# EAGLE design drive_board (EAGLE 8.4.0)
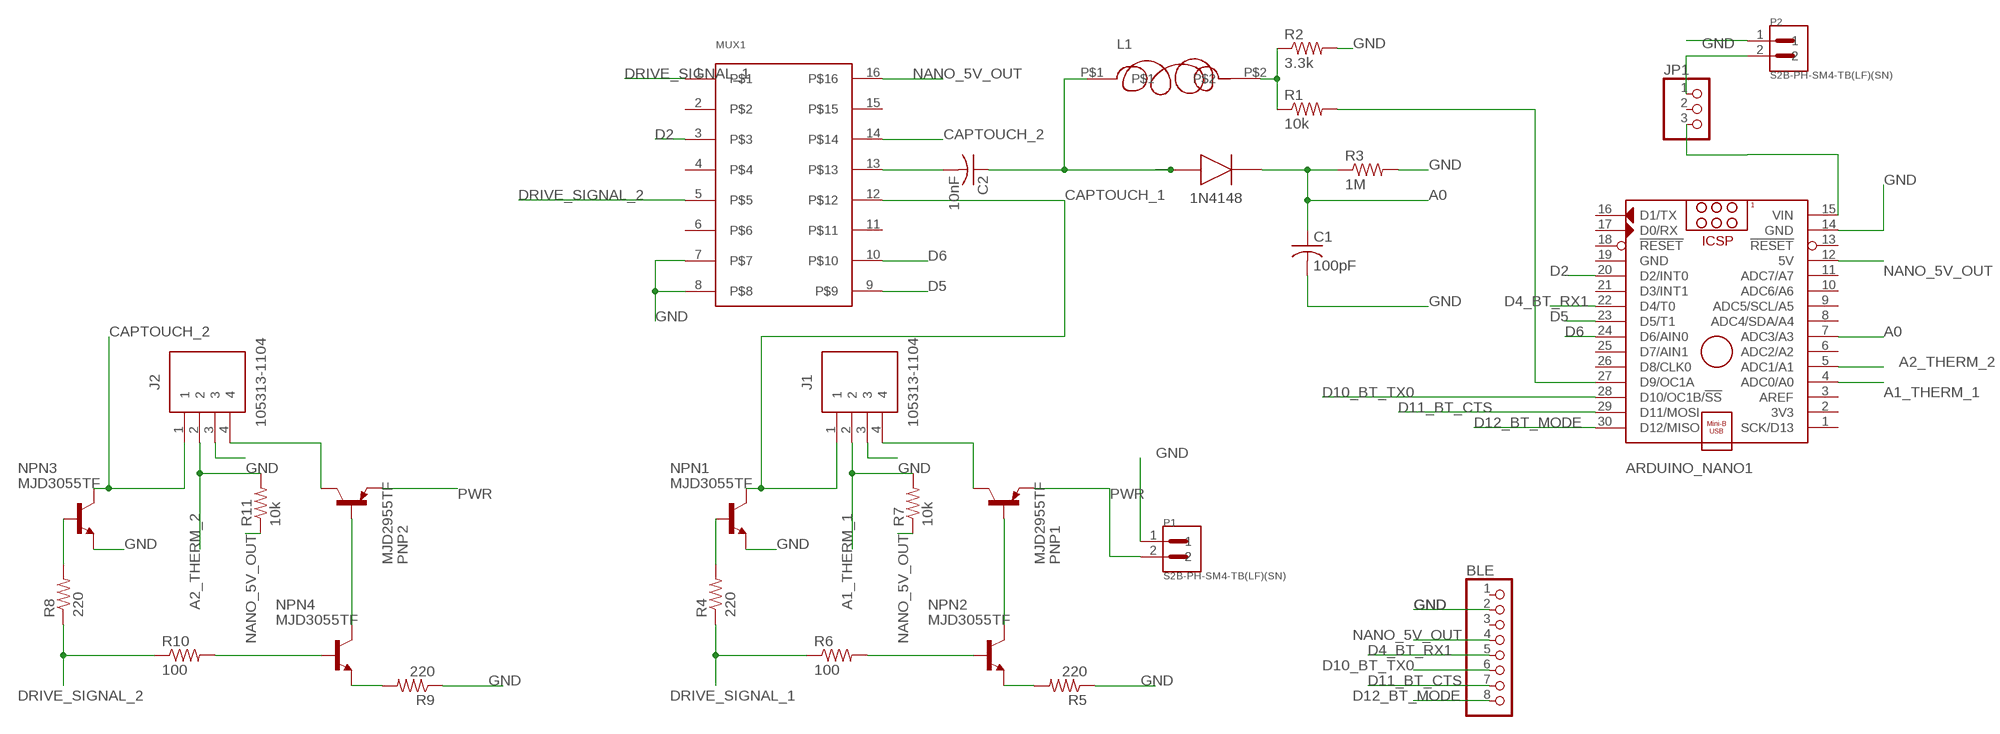
[diagram p0: schematic, sheet 1]

## Parts
1N4148  1N5819HW-7-F  [SOD3716X145N]
ARDUINO_NANO1  ARDUINO_NANO  [ARDUINO_NANO]
BLE  PINHD-1X8  [1X08]
C1  100pF  C-USC0805  [C0805]
C2  10nF  C-USC0805  [C0805]
J1  105313-1104  [105313-1104]
J2  105313-1104  [105313-1104]
JP1  PINHD-1X3  [1X03]
L1  SRE6603  [SRE6603]
MUX1  HAIRIO_MUX  [SO16]
NPN1  MJD3055TF  MJD31  [DPAK]
NPN2  MJD3055TF  MJD31  [DPAK]
NPN3  MJD3055TF  MJD31  [DPAK]
NPN4  MJD3055TF  MJD31  [DPAK]
P1  S2B-PH-SM4-TB(LF)(SN)  [JST_S2B-PH-SM4-TB(LF)(SN)]
P2  S2B-PH-SM4-TB(LF)(SN)  [JST_S2B-PH-SM4-TB(LF)(SN)]
PNP1  MJD2955TF  MJD32  [DPAK]
PNP2  MJD2955TF  MJD32  [DPAK]
R1  10k  R-US_R0805  [R0805]
R2  3.3k  R-US_R0805  [R0805]
R3  1M  R-US_R0805  [R0805]
R4  220  R-US_R0805  [R0805]
R5  220  R-US_R0805  [R0805]
R6  100  R-US_R0805  [R0805]
R7  10k  R-US_R0805  [R0805]
R8  220  R-US_R0805  [R0805]
R9  220  R-US_R0805  [R0805]
R10  100  R-US_R0805  [R0805]
R11  10k  R-US_R0805  [R0805]

## Nets
A0: 1N4148.1(K) ARDUINO_NANO1.7(ADC3/A3) C1.1 R3.1
A1_THERM_1 [isolation]: ARDUINO_NANO1.4(ADC0/A0) J1.2 R7.2
A2_THERM_2: ARDUINO_NANO1.5(ADC1/A1) J2.2 R11.2
CAPTOUCH_1 [isolation]: J1.1 MUX1.12 NPN1.4(C)
CAPTOUCH_2: J2.1 MUX1.14 NPN3.4(C)
D2: ARDUINO_NANO1.20(D2/INT0) MUX1.3
D4_BT_RX1: ARDUINO_NANO1.22(D4/T0) BLE.5
D5: ARDUINO_NANO1.23(D5/T1) MUX1.9
D6: ARDUINO_NANO1.24(D6/AIN0) MUX1.10
D10_BT_TX0: ARDUINO_NANO1.28(D10/OC1B/!SS) BLE.6
D11_BT_CTS: ARDUINO_NANO1.29(D11/MOSI) BLE.7
D12_BT_MODE: ARDUINO_NANO1.30(D12/MISO) BLE.8
DRIVE_SIGNAL_1 [isolation]: MUX1.1 R4.1 R6.1
DRIVE_SIGNAL_2: MUX1.5 R8.1 R10.1
GND: ARDUINO_NANO1.14(GND) BLE.2 C1.2 J1.3 J2.3 MUX1.7 MUX1.8 NPN1.3(E) NPN3.3(E) P1.1 P2.1 R2.2 R3.2 R5.1 R9.1
N$1: NPN2.1(B) R6.2
N$2: NPN2.3(E) R5.2
N$3: NPN4.1(B) R10.2
N$4: NPN2.4(C) PNP1.1(B)
N$5: NPN1.1(B) R4.2
N$6: C2.2 MUX1.13
N$7: 1N4148.2(A) C2.1 L1.P$1
N$8: J1.4 PNP1.4(C)
N$9: ARDUINO_NANO1.27(D9/OC1A) R1.2
N$10: L1.P$2 R1.1 R2.1
N$11: NPN4.3(E) R9.2
N$12: ARDUINO_NANO1.15(VIN) JP1.3
N$13: NPN4.4(C) PNP2.1(B)
N$14: NPN3.1(B) R8.2
N$15: J2.4 PNP2.4(C)
N$16: JP1.1 P2.2
NANO_5V_OUT: ARDUINO_NANO1.12(5V) BLE.4 MUX1.16 R7.1 R11.1
PWR: P1.2 PNP1.3(E) PNP2.3(E)
Unconnected: ARDUINO_NANO1.1(SCK/D13) ARDUINO_NANO1.2(3V3) ARDUINO_NANO1.3(AREF) ARDUINO_NANO1.6(ADC2/A2) ARDUINO_NANO1.8(ADC4/SDA/A4) ARDUINO_NANO1.9(ADC5/SCL/A5) ARDUINO_NANO1.10(ADC6/A6) ARDUINO_NANO1.11(ADC7/A7) ARDUINO_NANO1.13(!RESET) ARDUINO_NANO1.16(D1/TX) ARDUINO_NANO1.17(D0/RX) ARDUINO_NANO1.18(!RESET) ARDUINO_NANO1.21(D3/INT1) ARDUINO_NANO1.25(D7/AIN1) ARDUINO_NANO1.26(D8/CLK0) BLE.1 BLE.3 JP1.2 MUX1.2 MUX1.4 MUX1.6 MUX1.11 MUX1.15

## Power pins joined to a net without a drawn wire
GND: ARDUINO_NANO1.19(GND)

## Library data of the parts
1N4148 = hairiodiode:1N5819HW-7-F: Diode Schottky 1A 40V SOD123 Diodes Inc 1N5819HW-7-F, SMT Schottky Diode, 40V 1A, 2-Pin SOD-123 <https://componentsearchengine.com/Images/3/1N5819HW-7-F.jpg> Source: Datasheet <http://www.diodes.com/_files/datasheets/ds30217.pdf>; ALLIED_NUMBER: 70437201; DESCRIPTION: Diode Schottky 1A 40V SOD123 Diodes Inc 1N5819HW-7-F, SMT Schottky Diode, 40V 1A, 2-Pin SOD-123; HEIGHT: 1.45mm; MANUFACTURER_NAME: Diodes Inc.; MANUFACTURER_PART_NUMBER: 1N5819HW-7-F; RS_PART_NUMBER: 9227964; SUPPLIER_NAME: RS
ARDUINO_NANO1 = ArduinoNanoV30:ARDUINO_NANO: Arduino Nano V3.0 Module Overview: The Arduino Nano is a small, complete, and breadboard-friendly board based on the ATmega328 (Arduino Nano 3.x) or ATmega168 (Arduino Nano 2.x). It has more or less the same functionality of the Arduino Duemilanove, but in a different package. It lacks only a DC power jack, and works with a Mini-B USB cable instead of a standard one. The Nano was designed and is being produced by Gravitech <http://www.gravitech.us/arna30wiatp.html>. General specifications: Item Value Microcontroller Atmel ATmega168 or ATmega328 Operating Voltage (logic level) 5 V Input Voltage (recommended) 7-12 V Input Voltage (limits) 6-20 V Digital I/O Pins 14 (of which 6 provide PWM output) Analog Input Pins 8 DC Current per I/O Pin 40 mA Flash Memory 16 KB (ATmega168) or 32 KB (ATmega328) of which 2 KB used by bootloader SRAM 1 KB (ATmega168) or 2 KB (ATmega328) EEPROM 512 bytes (ATmega168) or 1 KB (ATmega328) Clock Speed 16 MHz Dimensions (Inches) 0.73" x 1.70" Dimensions (mm) 18mm x 45mm Overall height About 9 mm (not including pins) Weigth 5 g Power: The Arduino Nano can be powered via the Mini-B USB connection, 6-20V unregulated external power supply (pin 30), or 5V regulated external power supply (pin 27). The power source is automatically selected to the highest voltage source. Memory: The ATmega168 has 16 KB of flash memory for storing code (of which 2 KB is used for the bootloader); the ATmega328 has 32 KB, (also with 2 KB used for the bootloader). The ATmega168 has 1 KB of SRAM and 512 bytes of EEPROM (which can be read and written with the EEPROM library); the ATmega328 has 2 KB of SRAM and 1 KB of EEPROM. Input and Output: Each of the 14 digital pins on the Nano can be used as an input or output, using pinMode(), digitalWrite(), and digitalRead() functions. They operate at 5 volts. Each pin can provide or receive a maximum of 40 mA and has an internal pull-up resistor (disconnected by default) of 20-50 kOhms. In addition, some pins have specialized functions. Visit Arduino - ArduinoBoardNano <https://www.arduino.cc/en/Main/ArduinoBoardNano>
BLE = pinhead:PINHD-1X8: PIN HEADER
C1 C2 = resistor:C-US: CAPACITOR, American symbol
J1 J2 = 105313-1104:105313-1104: Headers & Wire Housings NanoFit RA Hdr TH SR 4Ckt Tin Blk <https://componentsearchengine.com/Images/1/105313-1104.jpg> Source: Datasheet <http://www.molex.com/webdocs/datasheets/pdf/en-us//1053131104_PCB_HEADERS.pdf>; DESCRIPTION: Headers & Wire Housings NanoFit RA Hdr TH SR 4Ckt Tin Blk; HEIGHT: mm; MANUFACTURER_NAME: Molex; MANUFACTURER_PART_NUMBER: 105313-1104; SUPPLIER_NAME: RS
JP1 = pinhead:PINHD-1X3: PIN HEADER
L1 = HairIO:SRE6603: SRE6603 - Shielded SMD Power Inductor Technical Specifications: Test Voltage: 0.1V Operating Temperature: -25°C to 105°C Digikey: SRE6603-103MCT-ND Mouser: 652-SRE6603-103M
MUX1 = 40xx:HAIRIO_MUX
NPN1-NPN4 = transistor:MJD31*: Complementary Power Transistors
P1 P2 = S2B-PH-SM4-TB_LF__SN_:S2B-PH-SM4-TB(LF)(SN): CONN HEADER PH SIDE 2POS 2MM SMD; AVAILABILITY: Good; DESCRIPTION: CONN HEADER PH SIDE 2POS 2MM SMD; MF: JST; MP: S2B-PH-SM4-TB(LF)(SN); PACKAGE: FakePackage u; PRICE: 0.34 USD
PNP1 PNP2 = transistor:MJD32*: Complementary Power Transistors
R1-R11 = resistor:R-US_: RESISTOR, American symbol

## Board
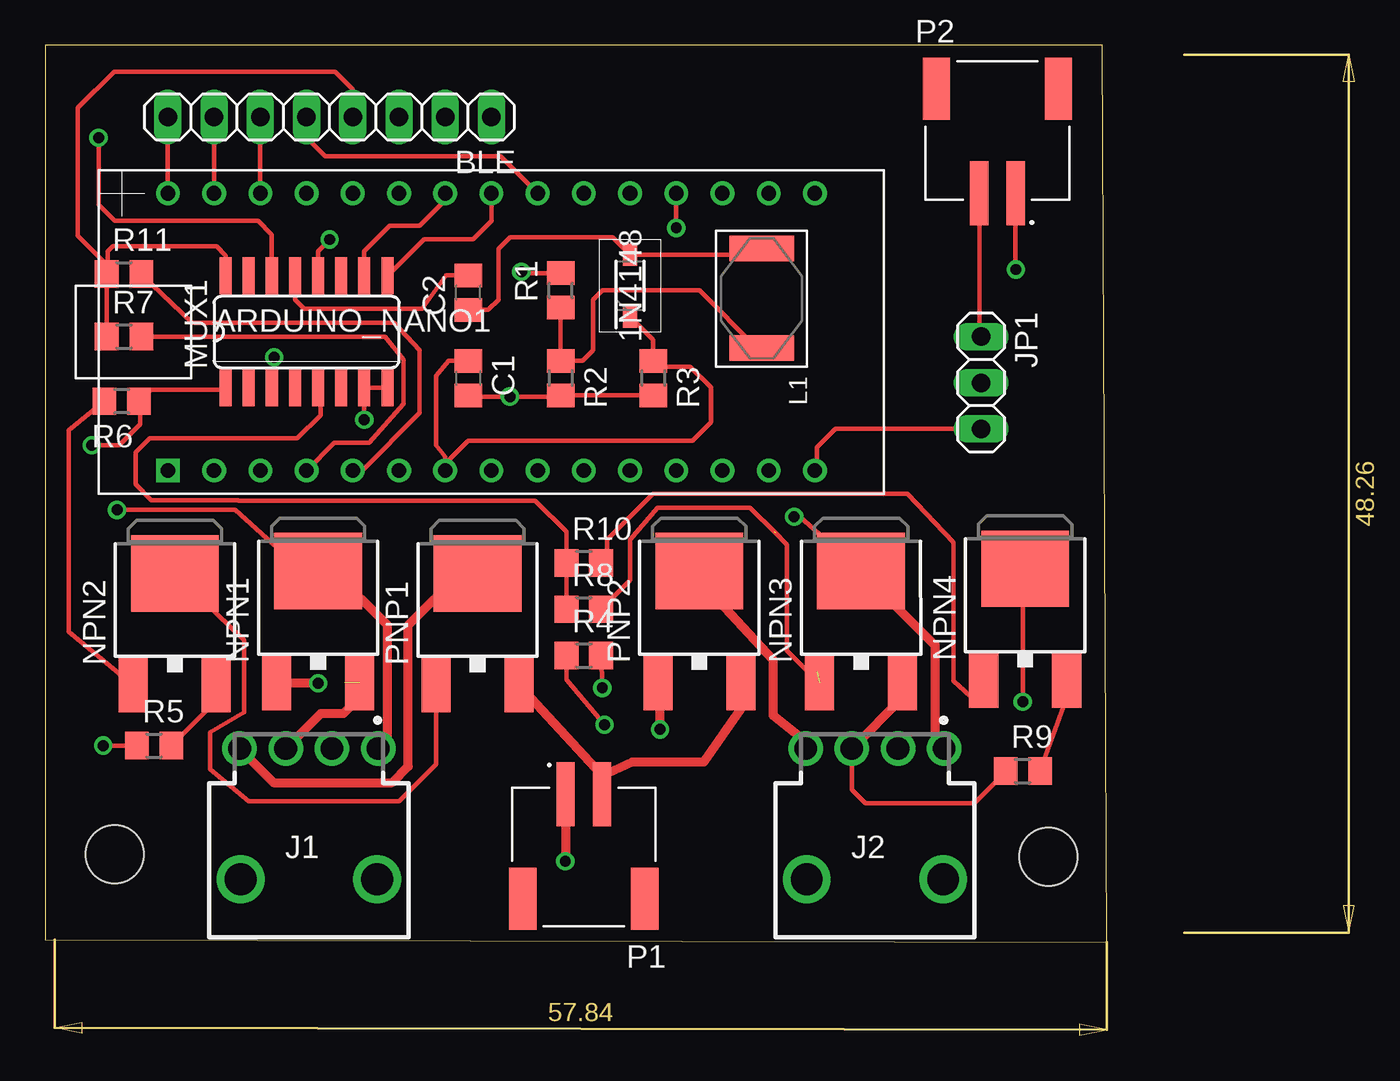
[diagram p1: board, top side]
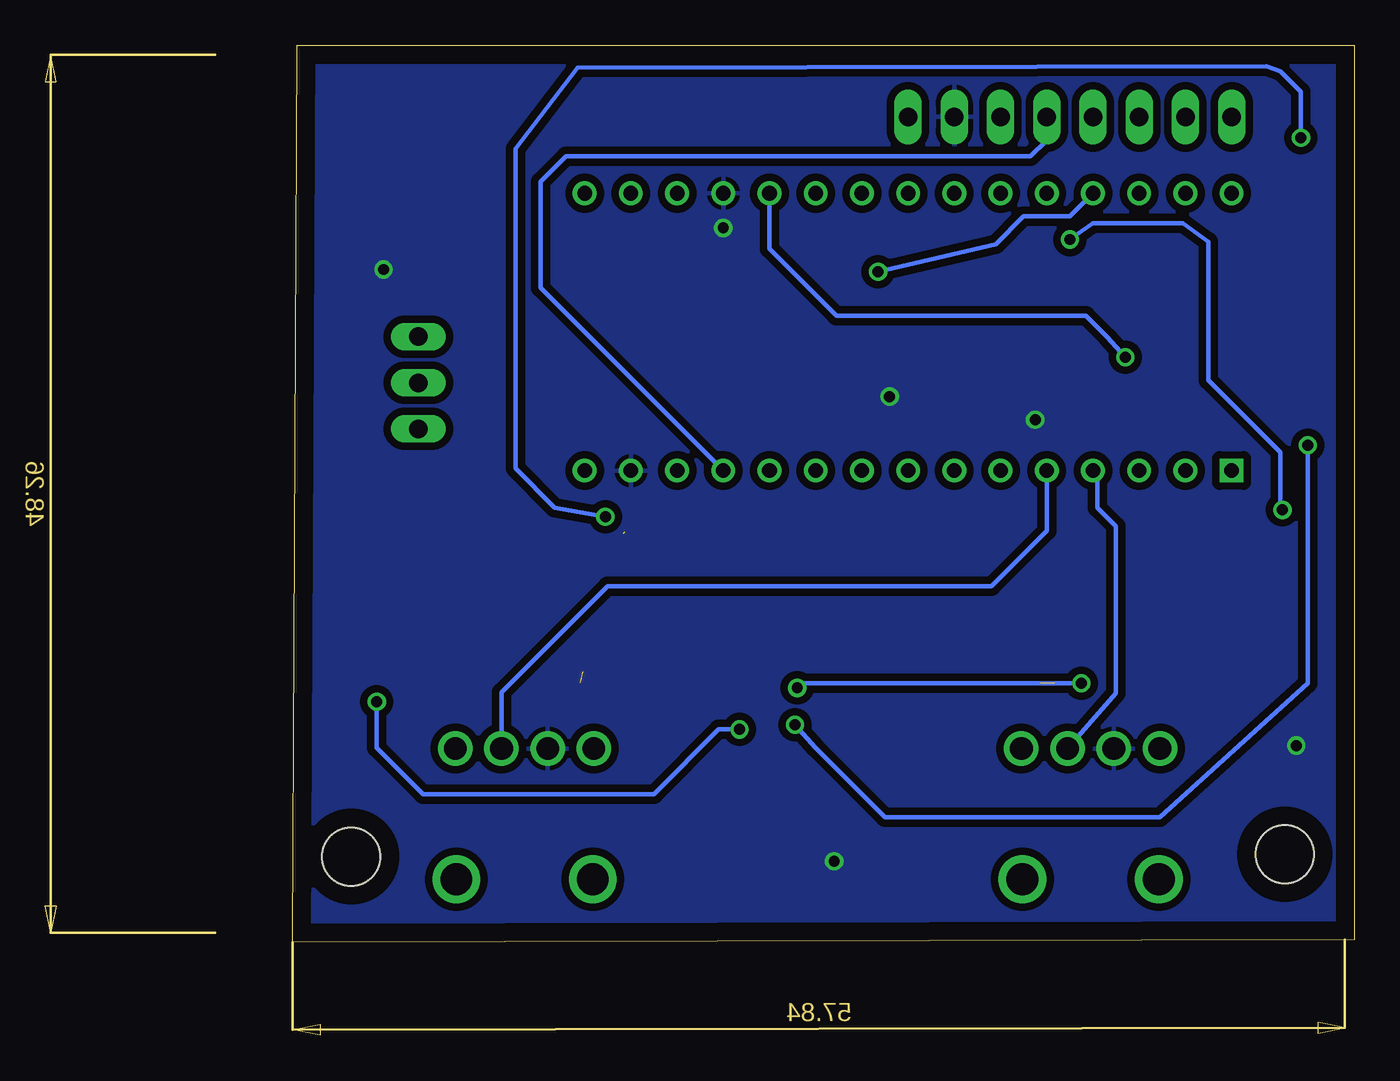
[diagram p2: board, bottom side, seen from below]

Size 58.34 x 49.27 mm. Coordinates in mm from the lower left corner, seen from the top.
Outline: 0,0.13 58.34,0 58.09,49.27 0,49.27 0,0.13
Copper layers (1*16): Top 0.035mm / dielectric 1.5mm / Bottom 0.035mm
Design rules "default": minimum track width 6mil, minimum drill 0.35mm, track to track 6mil, track to pad 6mil, pad to pad 6mil, via to via 6mil, smd to smd 6mil, copper to edge 40mil, drill to drill 6mil, minimum pad ring 10mil, minimum via ring 8mil, stop-mask expansion 4mil, vias tented up to drill 0mil, thermal gap 10mil
Holes 3.2 mm at 3.81,4.83 55.12,4.7

### Footprints (pad centres in the part's own frame; a part is rotated, then mirrored left to right if it is on the bottom)
SOD3716X145N = smd 1.2 x 0.75: 1 -1.7,0; 2 1.7,0
ARDUINO_NANO = drill 0.8 square: 1 -20.32,-7.62 | drill 0.8: 2 -17.78,-7.62; 3 -15.24,-7.62; 4 -12.7,-7.62; 5 -10.16,-7.62; 6 -7.62,-7.62; 7 -5.08,-7.62; 8 -2.54,-7.62; 9 0,-7.62; 10 2.54,-7.62; 11 5.08,-7.62; 12 7.62,-7.62; 13 10.16,-7.62; 14 12.7,-7.62; 15 15.24,-7.62; 16 15.24,7.62; 17 12.7,7.62; 18 10.16,7.62; 19 7.62,7.62; 20 5.08,7.62; 21 2.54,7.62; 22 0,7.62; 23 -2.54,7.62; 24 -5.08,7.62; 25 -7.62,7.62; 26 -10.16,7.62; 27 -12.7,7.62; 28 -15.24,7.62; 29 -17.78,7.62; 30 -20.32,7.62
1X08 = drill 1.016 long: 1 -8.89,0; 2 -6.35,0; 3 -3.81,0; 4 -1.27,0; 5 1.27,0; 6 3.81,0; 7 6.35,0; 8 8.89,0
C0805 = smd 1.3 x 1.5: 1 -0.95,0; 2 0.95,0
105313-1104 = drill 1.25 pad 1.9: 1 3.81,10.38; 2 1.27,10.38; 3 -1.27,10.38; 4 -3.81,10.38 | drill 1.75 pad 1.75: 5 3.75,3.2; 6 -3.75,3.2
1X03 = drill 1.016 long: 1 -2.54,0; 2 0,0; 3 2.54,0
SRE6603 = smd 1.4 x 3.56: P$1 0,0; P$2 5.46,0
SO16 = smd 0.66 x 2.032: 1 -4.445,-3.073; 2 -3.175,-3.073; 3 -1.905,-3.073; 4 -0.635,-3.073; 5 0.635,-3.073; 6 1.905,-3.073; 7 3.175,-3.073; 8 4.445,-3.073; 9 4.445,3.073; 10 3.175,3.073; 11 1.905,3.073; 12 0.635,3.073; 13 -0.635,3.073; 14 -1.905,3.073; 15 -3.175,3.073; 16 -4.445,3.073
DPAK = smd 1.6 x 3: 1 -2.28,-4.04; 3 2.28,-4.04 | smd 4.826 x 4.191: 4 0,2.096
JST_S2B-PH-SM4-TB(LF)(SN) = smd 1 x 3.5: 1 1,0; 2 -1,0 | smd 1.5 x 3.4: P1 3.35,5.75; P2 -3.35,5.75
R0805 = smd 1.3 x 1.5: 1 -0.95,0; 2 0.95,0

### Placement (x,y rotation side)
1N4148  32.13,36.07 90 top
ARDUINO_NANO1  27.05,33.53 0 top
BLE  15.62,45.34 180 top
C1  23.24,30.99 270 top
C2  23.24,35.69 90 top
J1  14.48,0.25 0 top
J2  45.59,0.25 0 top
JP1  51.43,30.73 270 top
L1  39.37,38.1 270 top
MUX1  14.35,33.53 0 top
NPN1  14.99,18.29 0 top
NPN2  7.11,18.16 0 top
NPN3  44.83,18.29 0 top
NPN4  53.85,18.42 0 top
P1  29.59,8.13 180 top
P2  52.32,41.15 0 top
PNP1  23.75,18.16 0 top
PNP2  35.94,18.29 0 top
R1  28.32,35.81 90 top
R2  28.32,30.99 270 top
R3  33.4,30.99 270 top
R4  29.59,15.75 0 top
R5  5.97,10.79 0 top
R6  4.19,29.72 180 top
R7  4.32,33.27 0 top
R8  29.59,18.29 0 top
R9  53.72,9.4 0 top
R10  29.59,20.83 0 top
R11  4.32,36.7 0 top

### Tracks (layer width: path | path; a pad name or v marks a point on that pad's centre or on a via)
A0
  Top 0.254: 1N4148.1 33.4,33.1 R3.1 33.72,31.62 35.43,31.62 36.58,30.48 36.58,28.57 35.56,27.56 23.24,27.56 21.97,26.29 ARDUINO_NANO1.7 21.97,26.67 21.46,27.31 21.46,31.11 22.16,31.94 C1.1 | 23.49,31.94 C1.1 | 23.24,31.83 C1.1
A1_THERM_1
  Top 0.254: R7.2 18.67,33.27 19.69,32 19.69,29.59 17.78,27.43 15.88,27.43 ARDUINO_NANO1.4
  Bottom 0.254: J1.2 13.08,13.68 13.08,22.86 14.1,23.88 14.1,25.65 ARDUINO_NANO1.4
A2_THERM_2
  Top 0.254: R11.2 8.06,34.04 19.18,34.04 20.57,32.51 20.57,29.08 17.4,25.91 ARDUINO_NANO1.5
  Bottom 0.254: J2.2 46.86,13.72 41.02,19.56 19.94,19.56 16.89,22.61 ARDUINO_NANO1.5
CAPTOUCH_1  (via drill 0.6)
  Top 0.254: MUX1.12 14.99,37.97 v15.62,38.61 | 18.38,10.89 J1.1 | v3.94,23.75 10.41,23.75 14.16,20.38 NPN1.4
  Top 0.508: J1.1 18.8,11.14 18.8,17.4 15.81,20.38 NPN1.4
  Bottom 0.254: v15.62,38.61 14.35,39.5 9.4,39.5 8,38.48 8,30.86 4.06,26.92 4.06,24 v3.94,23.75
CAPTOUCH_2  (via drill 0.6)
  Top 0.254: MUX1.14 12.45,38.86 11.68,39.62 3.81,39.62 2.92,40.51 v2.92,44.2 | NPN3.4 41.47,23.37 v41.15,23.37
  Top 0.508: NPN3.4 48.9,16.32 48.9,11.14 J2.1
  Bottom 0.254: v2.92,44.2 2.92,46.74 4.05,47.86 4.81,48.11 42.67,48.03 46.1,43.59 46.1,26.04 43.94,23.88 v41.15,23.37
D2  (via drill 0.6)
  Top 0.254: MUX1.3 12.57,30.58 v12.57,32.13
  Bottom 0.254: ARDUINO_NANO1.20 32.13,38.1 28.45,34.42 14.73,34.42 13.59,33.27 v12.57,32.13
D4_BT_RX1
  Top 0.254: BLE.5 14.35,44.2 15.37,43.18 25.02,43.18 ARDUINO_NANO1.22
D5
  Top 0.254: MUX1.9 20.8,38.61 23.49,38.61 24.51,39.62 ARDUINO_NANO1.23
D6
  Top 0.254: 17.53,37.07 MUX1.10 | MUX1.10 17.53,37.08 | MUX1.10 17.53,37.97 18.92,39.37 20.57,39.37 21.97,40.77 ARDUINO_NANO1.24
D10_BT_TX0
  Top 0.254: BLE.6 ARDUINO_NANO1.28
D11_BT_CTS
  Top 0.254: BLE.7 ARDUINO_NANO1.29
D12_BT_MODE
  Top 0.254: BLE.8 ARDUINO_NANO1.30
DRIVE_SIGNAL_1  (via drill 0.6)
  Top 0.152: 9.91,30.35 MUX1.1
  Top 0.254: R4.1 28.64,14.41 v30.73,11.94 | 9.91,30.35 5.78,30.35 R6.1 5.21,29.65 5.21,28.45 4.06,27.31 v2.54,27.31
  Bottom 0.254: v30.73,11.94 29.59,10.67 25.78,6.86 10.67,6.86 2.54,14.22 v2.54,27.31
DRIVE_SIGNAL_2
  Top 0.254: R8.1 R10.1 28.64,22.54 26.92,24.26 10.61,24.26 10.58,24.28 10.58,24.29 5.81,24.29 4.95,25.15 4.95,26.92 5.71,27.69 13.84,27.69 15.11,28.96 15.11,29.72 14.99,29.85 MUX1.5
GND  (via drill 0.6)  (1 unrouted)
  Top 0.254: v34.67,39.24 ARDUINO_NANO1.19 | P2.1 53.32,36.7 v53.34,36.96 | R3.2 R2.2 28.32,29.97 v25.53,29.97 23.24,29.97 C1.2 | MUX1.8 MUX1.7 v17.53,28.7 | 52.45,9.4 R9.1 52.77,9.34 51.05,7.62 45.09,7.62 44.32,8.38 J2.3 | R5.1 v3.17,10.79
  Top 0.508: P1.1 v28.58,4.45 | NPN3.3 47.11,13.42 J2.3 | J1.3 15.15,12.57 16.38,12.57 17.27,13.46 NPN1.3
  pour Bottom (isolate 0.406): 62.87,49.28 62.61,-8.38 -4.7,-8.38 -4.7,48.77 -1.91,49.28
N$1
  Top 0.254: NPN2.1 1.27,17.05 1.27,28.13 R6.2
N$2
  Top 0.254: NPN2.3 9.27,13.99 9.27,13.84 | 9.27,13.84 9.27,13.21 | R5.2 9.27,13.15 9.27,13.84
N$3
  Top 0.254: R10.2 30.86,21.15 30.86,22.1 33.4,24.64 47.37,24.64 49.91,21.97 49.91,14.35 51.18,13.21 51.18,14.13 NPN4.1
N$4
  Top 0.254: NPN2.4 10.92,16.57 10.92,12.63 9.06,11.52 9.06,9.49 11.18,7.75 19.43,7.75 21.46,9.78 21.46,13.85 21.35,13.96 | 21.35,13.96 20.96,13.47 | 21.35,13.96 PNP1.1
N$5  (via drill 0.6)
  Top 0.254: 15.11,14.22 15.09,14.25 15.06,14.22 v14.99,14.22 14.99,14.25 | 30.86,15.43 R4.2 v30.61,13.97
  Top 0.508: v14.99,14.22 12.73,14.22 NPN1.1
  Bottom 0.254: v30.61,13.97 30.35,14.22 v14.99,14.22
N$6
  Top 0.254: MUX1.13 13.72,35.31 14.22,34.8 20.7,34.8 22.03,36.64 C2.2
N$7
  Top 0.254: L1.P$1 39.04,37.77 1N4148.2 31.16,38.73 25.53,38.73 24.89,38.1 24.89,35.31 24.32,34.74 C2.1
N$8
  Top 0.508: J1.4 12.54,8.76 19.05,8.76 19.94,9.65 19.94,17.4 22.87,20.33 23.14,20.33 | 23.14,20.33 22.67,20.38 | 23.14,20.33 PNP1.4
N$9  (via drill 0.6)
  Top 0.254: R1.2 26.35,36.76 v26.16,36.83
  Bottom 0.254: ARDUINO_NANO1.27 15.62,39.88 18.16,39.88 19.69,38.35 v26.16,36.83
N$10
  Top 0.254: R1.1 R2.1 29.52,31.94 30.1,32.51 30.1,35.31 30.61,35.81 35.94,35.81 39.12,32.64 L1.P$2
N$11
  Top 0.254: R9.2 55.94,12.92 NPN4.3
N$12
  Top 0.254: ARDUINO_NANO1.15 42.42,26.04 42.42,27.18 43.43,28.19 JP1.3
N$13  (via drill 0.6)
  Top 0.254: 53.58,20.42 NPN4.4 | 53.58,20.42 54.23,20.51 | v53.72,13.21 53.72,20.28 53.58,20.42
  Top 0.508: v33.78,11.68 33.78,13.21 33.66,13.33 PNP2.1
  Bottom 0.254: v53.72,13.21 53.72,10.67 51.18,8.13 38.48,8.13 34.92,11.68 v33.78,11.68
N$14  (2 unrouted)
  Top 0.254: R8.2 32.13,19.88 32.13,22.1 33.66,23.88 38.73,23.88 40.16,22.45 | 40.07,22.54 40.77,21.84 40.77,16 42.29,14.48 42.42,14.86
N$15
  Top 0.254: 35.94,20.83 PNP2.4 35.88,20.38 35.69,20.19 35.43,19.94 35.81,19.94
  Top 0.508: J2.4 41.78,11.05 40.01,12.45 40.01,15.49 35.69,20.19
N$16
  Top 0.254: P2.2 51.32,33.39 JP1.1
NANO_5V_OUT
  Top 0.254: BLE.4 16.89,46.86 15.92,47.83 3.77,47.83 1.78,45.85 1.78,38.8 3.34,37.24 3.34,36.74 | R7.1 R11.1 | R11.1 3.34,36.74 | 3.34,36.74 3.24,36.2 | R11.1 3.43,36.76 3.43,37.97 3.68,38.23 9.4,38.23 9.91,37.72 MUX1.16
  Bottom 0.254: BLE.4 16.89,44.07 17.78,43.18 43.31,43.18 44.7,41.78 44.7,35.94 ARDUINO_NANO1.12
PWR
  Top 0.508: 38.48,13.99 PNP2.3 38.22,12.82 36.2,9.91 32.26,9.91 30.59,9.13 P1.2 30.59,9.18 PNP1.3